# Altium schematic sheet DC-DC TPS54627DDAR.SchDoc
size A3
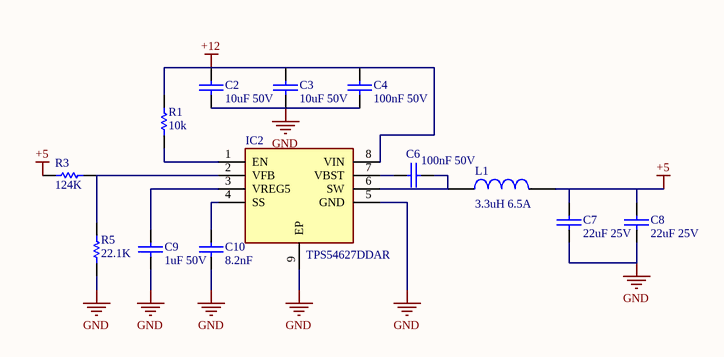
[diagram p0: DC-DC TPS54627DDAR.SchDoc]

## Parts
C2  10uF 50V  [1206C]
C3  10uF 50V  [1206C]
C4  100nF 50V  [0603C]
C6  100nF 50V  [0603C]
C7  22uF 25V  [0805C]
C8  22uF 25V  [0805C]
C9  1uF 50V  [0603C]
C10  8.2nF  [0603C]
IC2  TPS54627DDAR  [SOIC127P600X170-9N]
L1  3.3uH 6.5A  [SMD 7.3x6.6]
R1  10k  [0402R]
R3  124K  [0402R]
R5  22.1K  [0402R]

## Nets
+5: C7.2 C8.2 L1.2 R3.1
+12: C2.2 C3.2 C4.2 IC2.8(VIN) R1.2
GND: C2.1 C3.1 C4.1 C7.1 C8.1 C9.2 C10.1 IC2.5(GND) IC2.9(EP) R5.1
NetC6_1: C6.1 IC2.6(SW) L1.1
NetC6_2: C6.2 IC2.7(VBST)
NetC9_1: C9.1 IC2.3(VREG5)
NetC10_2: C10.2 IC2.4(SS)
NetIC2_1: IC2.1(EN) R1.1
NetIC2_2: IC2.2(VFB) R3.2 R5.2

## Library data of the parts
C2-C4 C6-C10 = CAP-NP
IC2 = TPS54627DDAR: Integrated Circuit; Manufacturer_Name: Texas Instruments; Datasheet Link: http://www.ti.com/lit/gpn/tps54627; Height: 1.7mm; Manufacturer_Part_Number: TPS54627DDAR; Arrow Part Number: TPS54627DDAR; Arrow Price/Stock: https://www.arrow.com/en/products/tps54627ddar/texas-instruments; Mouser Part Number: 595-TPS54627DDAR; Mouser Price/Stock: https://www.mouser.com/Search/Refine.aspx?Keyword=595-TPS54627DDAR
L1 = INDUCTOR: MHCI06030-3R3M-R8A; LCSC: C280586; ComponentLink1Description: LCSC; ComponentLink1URL: https://item.szlcsc.com/267006.html
R1 R3 R5 = RES